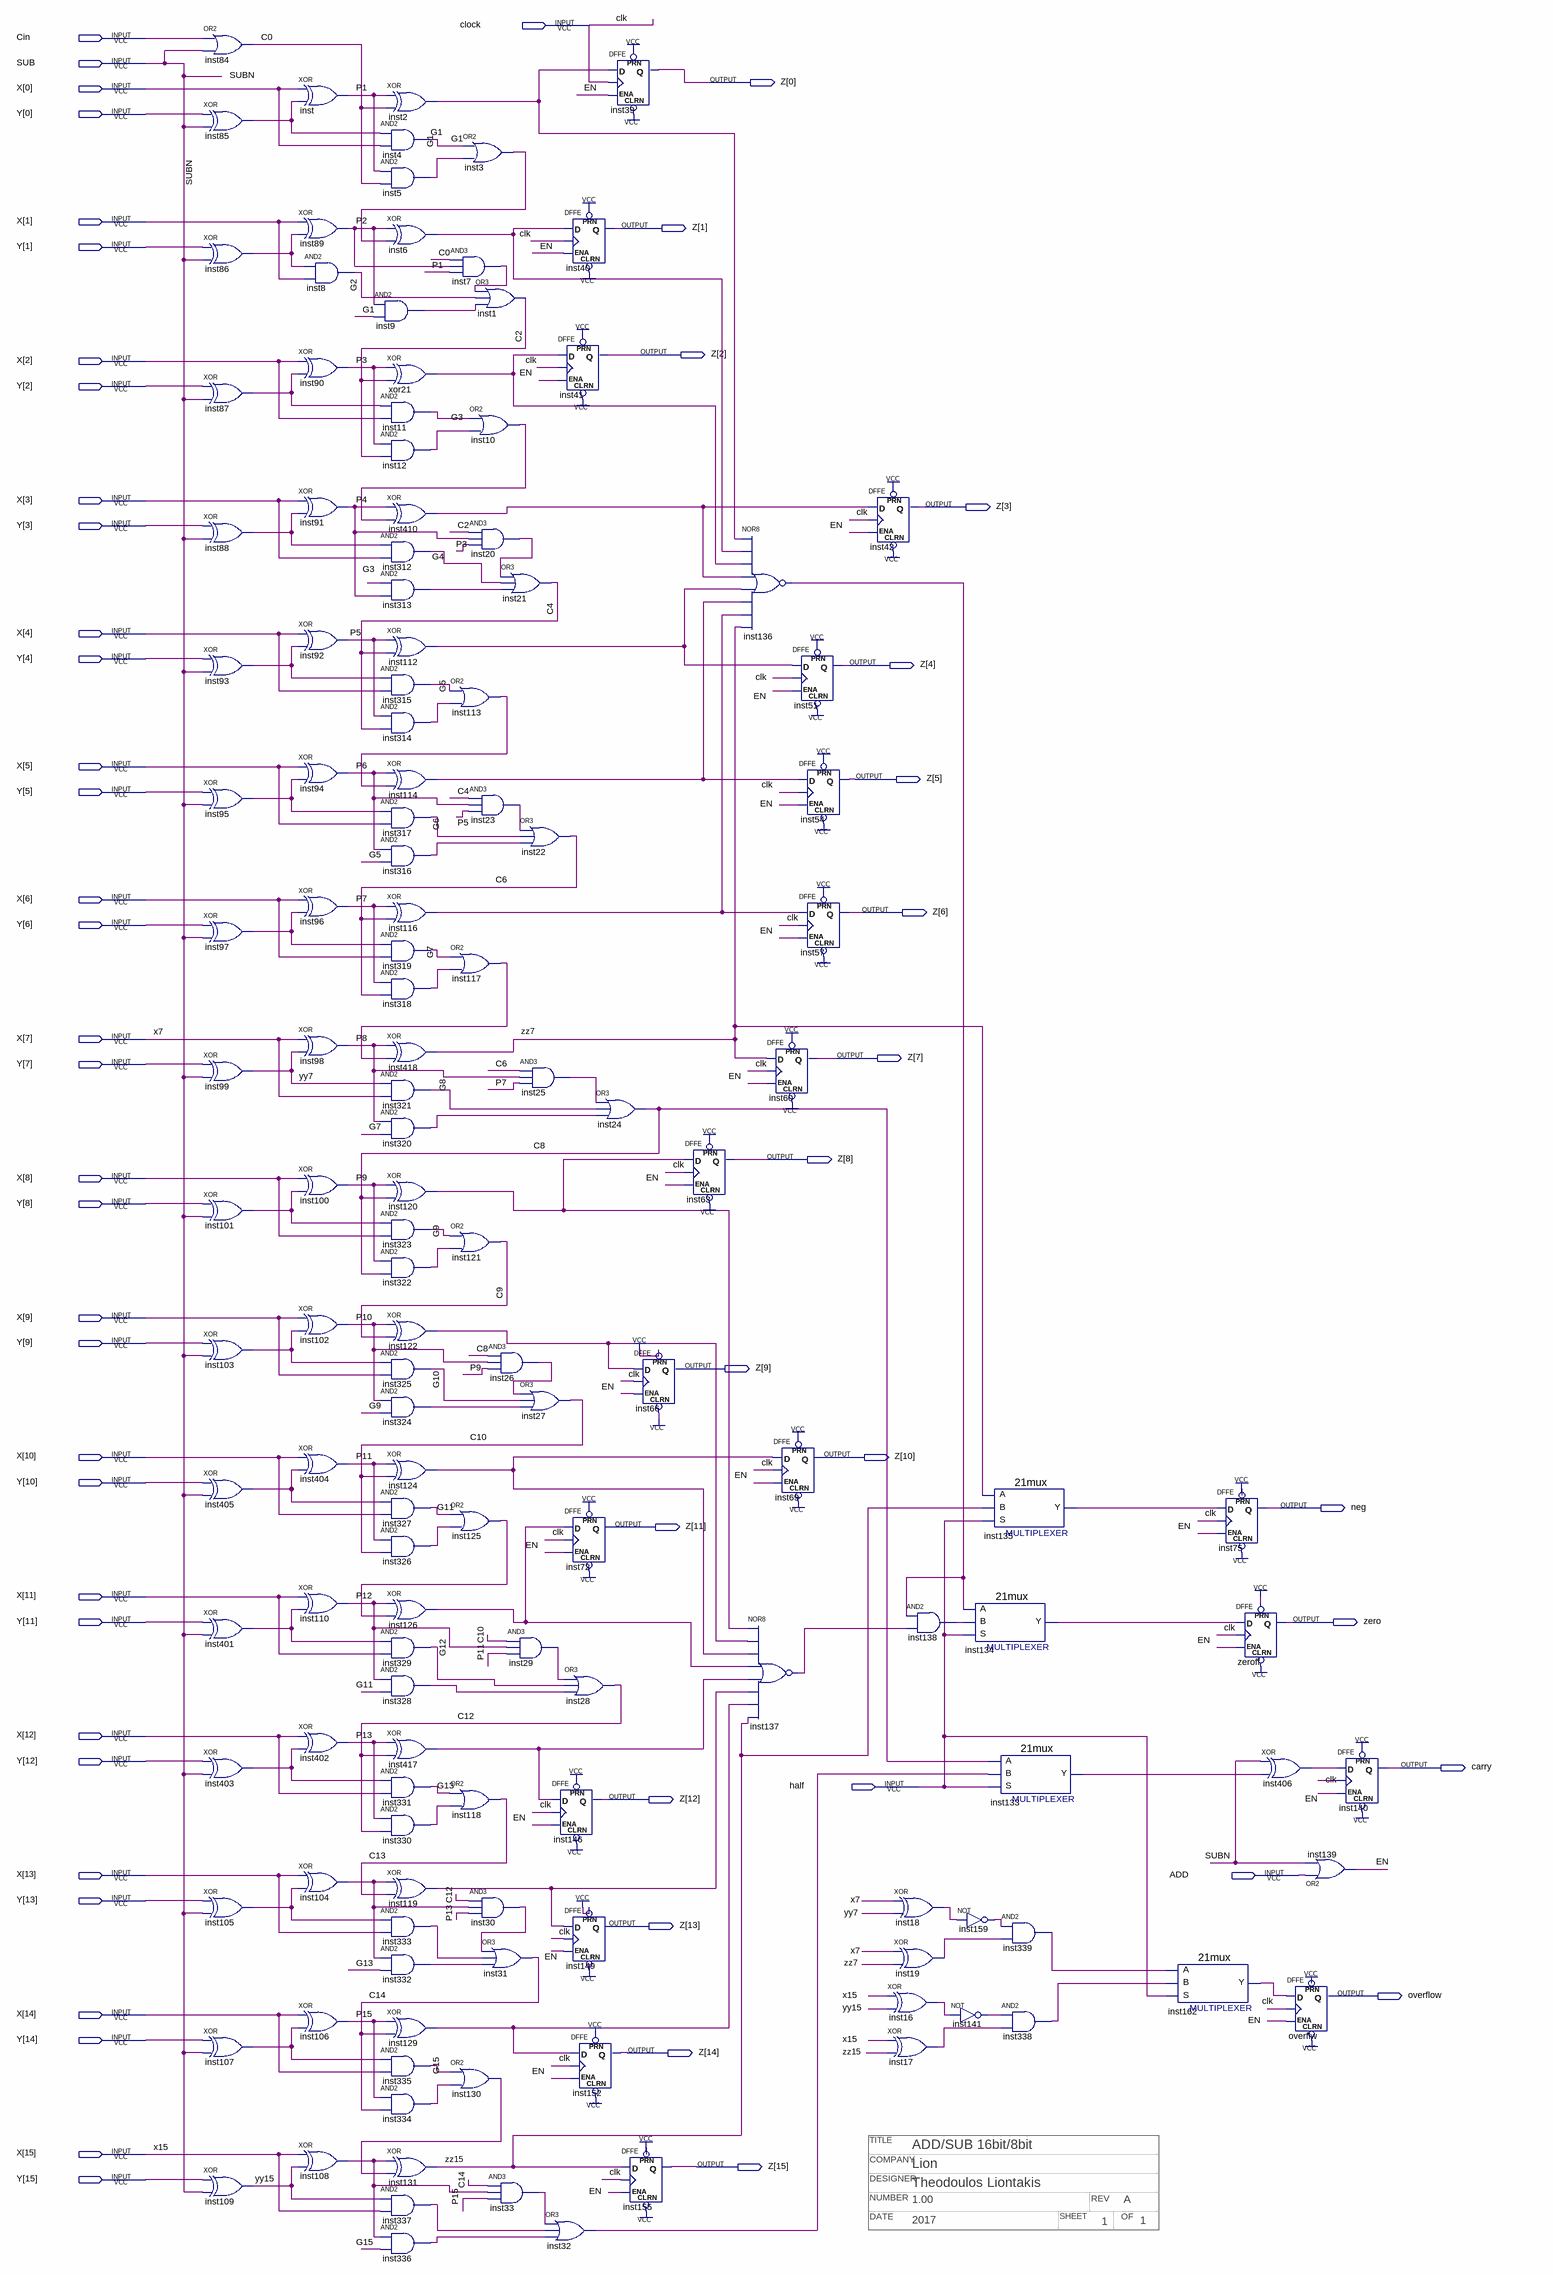
[diagram p0: schematic sheet]
// Quartus schematic ALU_LA2.bdf as structural Verilog: 142 symbols, 57 pins
// Title block: COMPANY: Lion; DATE: 2017; DESIGNER: Theodoulos Liontakis; NUMBER: 1.00; OF: 1; REV: A; SHEET: 1; TITLE: ADD/SUB 16bit/8bit
module ALU_LA2 (
  input  clock,
  input  Cin,
  input  SUB,
  input  [15:0] X,
  input  [15:0] Y,
  input  half,
  input  ADD,
  output [15:0] Z,
  output neg,
  output zero,
  output carry,
  output overflow
);

  wire C0, C2, C4, C6, C8, C9, C10, C12, C13, C14, EN, G1, G2, G3, G4, G5, G6, G7, G8, G9, G10, G11, G12,
       G13, G15, inst2_out, inst3_out, inst5_out, inst6_out, inst7_out, inst9_out, inst10_out, inst12_out,
       inst16_out, inst17_out, inst18_out, inst19_out, inst20_out, inst23_out, inst25_out, inst26_out,
       inst29_out, inst30_out, inst32_out, inst33_out, inst85_out, inst86_out, inst87_out, inst88_out,
       inst93_out, inst95_out, inst97_out, inst101_out, inst103_out, inst104_out, inst105_out, inst107_out,
       inst108_out, inst112_out, inst113_out, inst114_out, inst116_out, inst117_out, inst119_out,
       inst120_out, inst122_out, inst124_out, inst125_out, inst126_out, inst129_out, inst130_out, inst133_y,
       inst134_y, inst135_y, inst136_out, inst137_out, inst138_out, inst141_out, inst159_out, inst162_y,
       inst313_out, inst314_out, inst316_out, inst318_out, inst320_out, inst322_out, inst324_out,
       inst326_out, inst328_out, inst330_out, inst332_out, inst333_out, inst334_out, inst336_out,
       inst337_out, inst338_out, inst339_out, inst401_out, inst403_out, inst405_out, inst406_out,
       inst410_out, inst417_out, P1, P2, P3, P4, P5, P6, P7, P8, P9, P10, P11, P12, P13, P15, xor21_out, yy7,
       yy15, zz7, zz15;

  or inst84 (C0, Cin, SUB);
  xor inst85 (inst85_out, Y[0], SUB);
  xor inst86 (inst86_out, Y[1], SUB);
  xor inst87 (inst87_out, Y[2], SUB);
  xor inst88 (inst88_out, Y[3], SUB);
  xor inst93 (inst93_out, Y[4], SUB);
  xor inst95 (inst95_out, Y[5], SUB);
  xor inst97 (inst97_out, Y[6], SUB);
  xor inst99 (yy7, Y[7], SUB);
  xor inst101 (inst101_out, Y[8], SUB);
  xor inst103 (inst103_out, Y[9], SUB);
  xor inst405 (inst405_out, Y[10], SUB);
  xor inst401 (inst401_out, Y[11], SUB);
  xor inst403 (inst403_out, Y[12], SUB);
  xor inst105 (inst105_out, Y[13], SUB);
  xor inst107 (inst107_out, Y[14], SUB);
  xor inst109 (yy15, Y[15], SUB);
  xor inst (P1, X[0], inst85_out);
  xor inst89 (P2, X[1], inst86_out);
  and inst8 (G2, inst86_out, X[1]);
  xor inst90 (P3, X[2], inst87_out);
  xor inst91 (P4, X[3], inst88_out);
  xor inst92 (P5, X[4], inst93_out);
  xor inst94 (P6, X[5], inst95_out);
  xor inst96 (P7, X[6], inst97_out);
  xor inst98 (P8, X[7], yy7);
  xor inst100 (P9, X[8], inst101_out);
  xor inst102 (P10, X[9], inst103_out);
  xor inst404 (P11, X[10], inst405_out);
  xor inst110 (P12, X[11], inst401_out);
  xor inst402 (P13, X[12], inst403_out);
  xor inst104 (inst104_out, X[13], inst105_out);
  xor inst106 (P15, X[14], inst107_out);
  xor inst108 (inst108_out, X[15], yy15);
  and inst4 (G1, inst85_out, X[0]);
  and inst5 (inst5_out, P1, C0);
  and inst9 (inst9_out, P2, G1);
  and inst11 (G3, inst87_out, X[2]);
  and inst12 (inst12_out, P3, C2);
  and inst312 (G4, inst88_out, X[3]);
  and inst313 (inst313_out, G3, P4);
  and inst315 (G5, inst93_out, X[4]);
  and inst314 (inst314_out, P5, C4);
  and inst317 (G6, inst95_out, X[5]);
  and inst316 (inst316_out, P6, G5);
  and inst319 (G7, inst97_out, X[6]);
  and inst318 (inst318_out, P7, C6);
  and inst321 (G8, yy7, X[7]);
  and inst320 (inst320_out, P8, G7);
  and inst323 (G9, inst101_out, X[8]);
  and inst322 (inst322_out, P9, C8);
  and inst325 (G10, inst103_out, X[9]);
  and inst324 (inst324_out, P10, G9);
  and inst327 (G11, inst405_out, X[10]);
  and inst326 (inst326_out, P11, C10);
  and inst329 (G12, inst401_out, X[11]);
  and inst328 (inst328_out, P12, G11);
  and inst331 (G13, inst403_out, X[12]);
  and inst330 (inst330_out, P13, C12);
  and inst333 (inst333_out, inst105_out, X[13]);
  and inst332 (inst332_out, inst104_out, G13);
  and inst335 (G15, inst107_out, X[14]);
  and inst334 (inst334_out, P15, C14);
  and inst337 (inst337_out, yy15, X[15]);
  and inst336 (inst336_out, inst108_out, G15);
  xor inst2 (inst2_out, P1, C0);
  xor inst6 (inst6_out, P2, inst3_out);
  xor xor21 (xor21_out, P3, C2);
  xor inst410 (inst410_out, P4, inst10_out);
  xor inst112 (inst112_out, P5, C4);
  xor inst114 (inst114_out, P6, inst113_out);
  xor inst116 (inst116_out, P7, C6);
  xor inst418 (zz7, P8, inst117_out);
  xor inst120 (inst120_out, P9, C8);
  xor inst122 (inst122_out, P10, C9);
  xor inst124 (inst124_out, P11, C10);
  xor inst126 (inst126_out, P12, inst125_out);
  xor inst417 (inst417_out, P13, C12);
  xor inst119 (inst119_out, inst104_out, C13);
  xor inst129 (inst129_out, P15, C14);
  xor inst131 (zz15, inst108_out, inst130_out);
  or inst3 (inst3_out, G1, inst5_out);
  and inst7 (inst7_out, C0, P2, P1);
  or inst1 (C2, inst7_out, G2, inst9_out);
  or inst10 (inst10_out, G3, inst12_out);
  and inst20 (inst20_out, C2, P4, P3);
  or inst113 (inst113_out, G5, inst314_out);
  and inst23 (inst23_out, C4, P6, P5);
  or inst117 (inst117_out, G7, inst318_out);
  or inst121 (C9, G9, inst322_out);
  or inst125 (inst125_out, G11, inst326_out);
  or inst118 (C13, G13, inst330_out);
  and inst30 (inst30_out, C12, inst104_out, P13);
  or inst31 (C14, inst30_out, inst333_out, inst332_out);
  or inst130 (inst130_out, G15, inst334_out);
  or inst21 (C4, inst20_out, G4, inst313_out);
  or inst22 (C6, inst23_out, G6, inst316_out);
  and inst25 (inst25_out, C6, P8, P7);
  and inst26 (inst26_out, C8, P10, P9);
  or inst27 (C10, inst26_out, G10, inst324_out);
  and inst29 (inst29_out, C10, P12, P11);
  and inst33 (inst33_out, C14, inst108_out, P15);
  DFFE inst40 (.PRN(1'b1), .CLRN(1'b1), .D(inst6_out), .CLK(clock), .ENA(EN), .Q(Z[1]));
  DFFE inst41 (.PRN(1'b1), .CLRN(1'b1), .D(xor21_out), .CLK(clock), .ENA(EN), .Q(Z[2]));
  DFFE inst72 (.PRN(1'b1), .CLRN(1'b1), .D(inst126_out), .CLK(clock), .ENA(EN), .Q(Z[11]));
  or inst28 (C12, inst29_out, G12, inst328_out);
  DFFE inst146 (.PRN(1'b1), .CLRN(1'b1), .D(inst417_out), .CLK(clock), .ENA(EN), .Q(Z[12]));
  DFFE inst149 (.PRN(1'b1), .CLRN(1'b1), .D(inst119_out), .CLK(clock), .ENA(EN), .Q(Z[13]));
  DFFE inst152 (.PRN(1'b1), .CLRN(1'b1), .D(inst129_out), .CLK(clock), .ENA(EN), .Q(Z[14]));
  or inst32 (inst32_out, inst33_out, inst337_out, inst336_out);
  DFFE inst39 (.PRN(1'b1), .CLRN(1'b1), .D(inst2_out), .CLK(clock), .ENA(EN), .Q(Z[0]));
  or inst24 (C8, inst25_out, G8, inst320_out);
  DFFE inst66 (.PRN(1'b1), .CLRN(1'b1), .D(inst122_out), .CLK(clock), .ENA(EN), .Q(Z[9]));
  DFFE inst155 (.PRN(1'b1), .CLRN(1'b1), .D(zz15), .CLK(clock), .ENA(EN), .Q(Z[15]));
  DFFE inst63 (.PRN(1'b1), .CLRN(1'b1), .D(inst120_out), .CLK(clock), .ENA(EN), .Q(Z[8]));
  nor inst136 (inst136_out, inst2_out, inst6_out, xor21_out, inst410_out, inst112_out, inst114_out, inst116_out, zz7);
  DFFE inst60 (.PRN(1'b1), .CLRN(1'b1), .D(zz7), .CLK(clock), .ENA(EN), .Q(Z[7]));
  DFFE inst69 (.PRN(1'b1), .CLRN(1'b1), .D(inst124_out), .CLK(clock), .ENA(EN), .Q(Z[10]));
  nor inst137 (inst137_out, inst120_out, inst122_out, inst124_out, inst126_out, inst417_out, inst119_out, inst129_out, zz15);
  DFFE inst51 (.PRN(1'b1), .CLRN(1'b1), .D(inst112_out), .CLK(clock), .ENA(EN), .Q(Z[4]));
  DFFE inst54 (.PRN(1'b1), .CLRN(1'b1), .D(inst114_out), .CLK(clock), .ENA(EN), .Q(Z[5]));
  DFFE inst57 (.PRN(1'b1), .CLRN(1'b1), .D(inst116_out), .CLK(clock), .ENA(EN), .Q(Z[6]));
  DFFE inst42 (.PRN(1'b1), .CLRN(1'b1), .D(inst410_out), .CLK(clock), .ENA(EN), .Q(Z[3]));
  xor inst16 (inst16_out, X[15], yy15);
  xor inst17 (inst17_out, X[15], zz15);
  and inst138 (inst138_out, inst136_out, inst137_out);
  xor inst18 (inst18_out, X[7], yy7);
  xor inst19 (inst19_out, X[7], zz7);
  \21mux  inst135 (.S(half), .B(zz15), .A(zz7), .Y(inst135_y));
  \21mux  inst134 (.S(half), .B(inst138_out), .A(inst136_out), .Y(inst134_y));
  \21mux  inst133 (.S(half), .B(inst32_out), .A(C8), .Y(inst133_y));
  not inst159 (inst159_out, inst18_out);
  not inst141 (inst141_out, inst16_out);
  and inst339 (inst339_out, inst159_out, inst19_out);
  and inst338 (inst338_out, inst141_out, inst17_out);
  \21mux  inst162 (.S(half), .B(inst338_out), .A(inst339_out), .Y(inst162_y));
  DFFE inst75 (.PRN(1'b1), .CLRN(1'b1), .D(inst135_y), .CLK(clock), .ENA(EN), .Q(neg));
  DFFE zeroff (.PRN(1'b1), .CLRN(1'b1), .D(inst134_y), .CLK(clock), .ENA(EN), .Q(zero));
  xor inst406 (inst406_out, SUB, inst133_y);
  DFFE overflw (.PRN(1'b1), .CLRN(1'b1), .D(inst162_y), .CLK(clock), .ENA(EN), .Q(overflow));
  DFFE inst140 (.PRN(1'b1), .CLRN(1'b1), .D(inst406_out), .CLK(clock), .ENA(EN), .Q(carry));
  or inst139 (EN, ADD, SUB);

  // Other names for the same wires on the sheet: clk = clock; SUBN = SUB
endmodule
